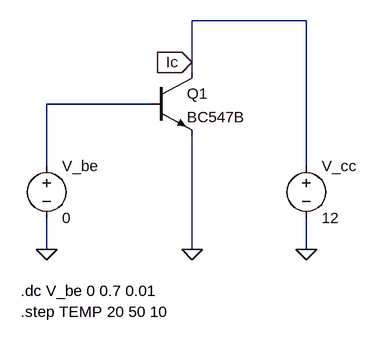
[diagram p0: schematic Q32.asc]
Q32.asc, the LTspice schematic file:
Version 4.1
SHEET 1 880 680
WIRE 480 -96 304 -96
WIRE 304 -32 304 -96
WIRE 304 -16 304 -32
WIRE 240 32 80 32
WIRE 80 128 80 32
WIRE 480 128 480 -96
WIRE 80 256 80 208
WIRE 304 256 304 80
WIRE 480 256 480 208
FLAG 80 256 0
FLAG 304 256 0
FLAG 480 256 0
FLAG 304 -32 Ic
IOPIN 304 -32 In
SYMBOL voltage 80 112 R0
SYMATTR InstName V_be
SYMATTR Value 0
SYMBOL npn 240 -16 R0
SYMATTR InstName Q1
SYMATTR Value BC547B
SYMBOL voltage 480 112 R0
SYMATTR InstName V_cc
SYMATTR Value 12
TEXT 40 320 Left 2 !.dc V_be 0 0.7 0.01
TEXT 40 352 Left 2 !.step TEMP 20 50 10

The netlist it stands for:
* Q32.asc
V_be N001 0 0
Q1 Ic N001 0 0 BC547B
V_cc Ic 0 12
.model NPN NPN
.model PNP PNP
.lib standard.bjt
.dc V_be 0 0.7 0.01
.step TEMP 20 50 10
.backanno
.end